# EAGLE design Switch (EAGLE 7.6.0)
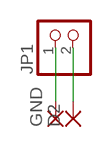
[diagram p0: schematic, sheet 1]

## Parts
D2  2,15/1,0  [2,15/1,0]
GND  2,15/1,0  [2,15/1,0]
JP1  PINHD-1X2  [1X02]

## Nets
N$1: GND.1(P) JP1.1
N$2: D2.1(P) JP1.2

## Library data of the parts
D2 GND = wirepad:2,15/1,0: THROUGH-HOLE PAD
JP1 = pinhead:PINHD-1X2: PIN HEADER

## Board
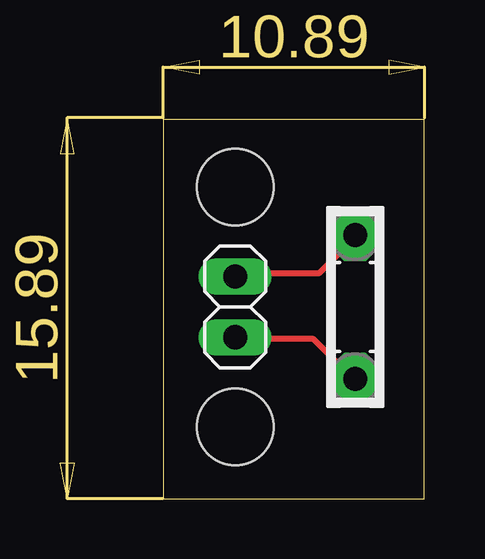
[diagram p1: board, top side]
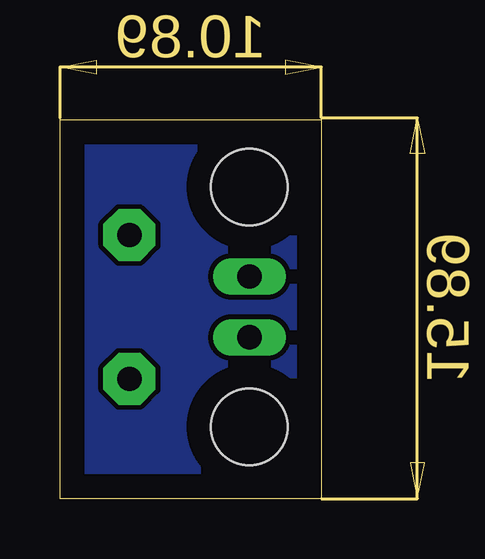
[diagram p2: board, bottom side, seen from below]

Size 10.87 x 15.81 mm. Coordinates in mm from the lower left corner, seen from the top.
Outline: 0,0 10.87,0 10.87,15.81 0,15.81 0,0
Copper layers (1*16): Top 0.035mm / dielectric 1.5mm / Bottom 0.035mm
Design rules "default": minimum track width 10mil, minimum drill 24mil, track to track 8mil, track to pad 8mil, pad to pad 8mil, via to via 8mil, smd to smd 8mil, copper to edge 40mil, drill to drill 8mil, minimum pad ring 10mil, minimum via ring 8mil, stop-mask expansion 4mil, vias tented up to drill 0mil, thermal gap 10mil
Holes 3.2 mm at 3,13 3,3

### Footprints (pad centres in the part's own frame; a part is rotated, then mirrored left to right if it is on the bottom)
2,15/1,0 = drill 1.016 pad 2.159 octagon: 1 0,0
1X02 = drill 1.016 long: 1 -1.27,0; 2 1.27,0

### Placement (x,y rotation side)
D2  8,11 90 top
GND  8,5 0 top
JP1  3,8 90 top

### Tracks (layer width: path | path; a pad name or v marks a point on that pad's centre or on a via)
GND
  Top 0.254: 8.31,4.14 8.31,4.22
  pour Bottom: 0,0 10.89,0 10.89,15.89 0,15.89
  pour Top: 0,0 0,15.89 10.89,15.89 10.89,0
N$1
  Top 0.254: JP1.1 3.06,6.66 6.26,6.66 7.86,5.06 GND.1
N$2
  Top 0.254: JP1.2 3.06,9.4 6.49,9.4 7.86,10.77 D2.1